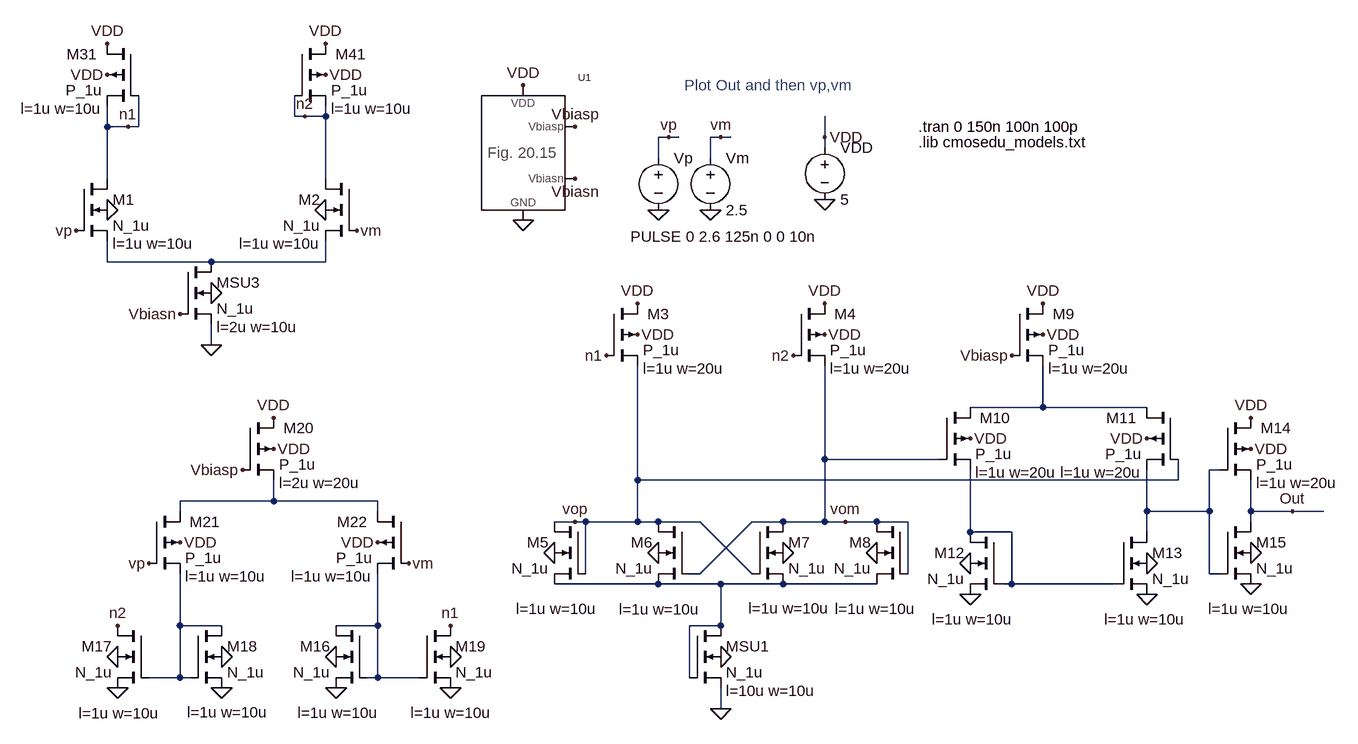
[diagram p0: schematic Fig27_13.asc]
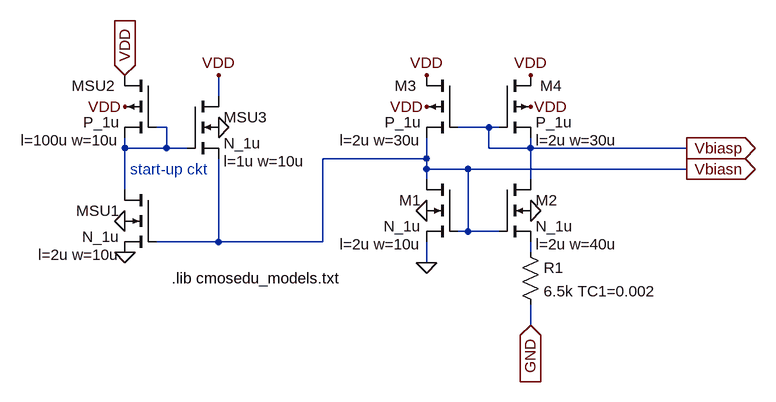
[diagram p1: sub-circuit fig_20_15.asc]
Fig27_13.asc, the LTspice schematic file:
Version 4
SHEET 1 2792 680
WIRE 672 -608 672 -640
WIRE 672 -528 672 -608
WIRE 672 -400 672 -432
WIRE 704 -608 672 -608
WIRE 720 -608 704 -608
WIRE 720 -608 720 -656
WIRE 784 -16 784 -32
WIRE 784 160 784 80
WIRE 784 240 736 240
WIRE 784 240 784 160
WIRE 800 240 784 240
WIRE 832 -400 672 -400
WIRE 832 -272 832 -304
WIRE 848 160 784 160
WIRE 928 -32 784 -32
WIRE 928 -32 928 -64
WIRE 960 -624 960 -656
WIRE 976 -624 960 -624
WIRE 1008 -624 976 -624
WIRE 1008 -624 1008 -640
WIRE 1008 -528 1008 -624
WIRE 1008 -400 832 -400
WIRE 1008 -400 1008 -432
WIRE 1088 -32 928 -32
WIRE 1088 -16 1088 -32
WIRE 1088 160 1024 160
WIRE 1088 160 1088 80
WIRE 1088 240 1072 240
WIRE 1088 240 1088 160
WIRE 1152 240 1088 240
WIRE 1392 0 1360 0
WIRE 1408 0 1392 0
WIRE 1408 80 1408 0
WIRE 1488 -64 1488 -240
WIRE 1488 0 1408 0
WIRE 1488 0 1488 -64
WIRE 1520 -560 1520 -592
WIRE 1520 0 1488 0
WIRE 1520 96 1360 96
WIRE 1536 -592 1520 -592
WIRE 1552 -592 1536 -592
WIRE 1568 240 1568 160
WIRE 1584 0 1520 0
WIRE 1584 80 1568 80
WIRE 1600 -560 1600 -592
WIRE 1616 -592 1600 -592
WIRE 1616 96 1520 96
WIRE 1616 160 1568 160
WIRE 1616 160 1616 96
WIRE 1616 288 1616 256
WIRE 1632 -592 1616 -592
WIRE 1664 0 1584 80
WIRE 1664 80 1584 0
WIRE 1712 0 1664 0
WIRE 1712 96 1616 96
WIRE 1776 -592 1776 -624
WIRE 1776 -576 1776 -592
WIRE 1776 -96 1776 -240
WIRE 1776 0 1712 0
WIRE 1776 0 1776 -96
WIRE 1808 0 1776 0
WIRE 1856 0 1808 0
WIRE 1856 96 1712 96
WIRE 1904 0 1856 0
WIRE 1904 80 1904 0
WIRE 1952 -96 1776 -96
WIRE 2000 16 2000 -80
WIRE 2064 16 2000 16
WIRE 2064 96 2048 96
WIRE 2064 96 2064 16
WIRE 2112 -176 2000 -176
WIRE 2112 -176 2112 -240
WIRE 2224 96 2064 96
WIRE 2272 -176 2112 -176
WIRE 2272 -16 2272 -80
WIRE 2272 16 2272 -16
WIRE 2320 -64 1488 -64
WIRE 2320 -64 2320 -96
WIRE 2368 -16 2272 -16
WIRE 2368 -16 2368 -80
WIRE 2368 80 2368 -16
WIRE 2384 -80 2368 -80
WIRE 2384 80 2368 80
WIRE 2432 -16 2432 -64
WIRE 2432 0 2432 -16
WIRE 2496 -16 2432 -16
WIRE 2544 -16 2496 -16
FLAG 1776 -496 0
FLAG 1776 -592 VDD
FLAG 832 -352 0
FLAG 672 -688 VDD
FLAG 1008 -688 VDD
FLAG 1312 -672 VDD
FLAG 1312 -464 0
FLAG 1392 -608 Vbiasp
FLAG 1392 -528 Vbiasn
FLAG 832 -272 0
FLAG 784 -320 Vbiasn
FLAG 672 -736 VDD
FLAG 1008 -736 VDD
FLAG 672 -480 0
FLAG 1008 -480 0
FLAG 624 -448 vp
FLAG 1056 -448 vm
FLAG 1520 -480 0
FLAG 1536 -592 vp
FLAG 1600 -480 0
FLAG 1616 -592 vm
FLAG 1488 -288 VDD
FLAG 1488 -336 VDD
FLAG 1776 -288 VDD
FLAG 1776 -336 VDD
FLAG 1360 48 0
FLAG 1520 48 0
FLAG 1712 48 0
FLAG 1856 48 0
FLAG 1392 0 vop
FLAG 1808 0 vom
FLAG 1728 -256 n2
FLAG 1440 -256 n1
FLAG 1616 208 0
FLAG 1616 288 0
FLAG 2112 -288 VDD
FLAG 2112 -336 VDD
FLAG 2064 -256 Vbiasp
FLAG 2000 -128 VDD
FLAG 2272 -128 VDD
FLAG 2000 64 0
FLAG 2000 112 0
FLAG 2272 64 0
FLAG 2272 112 0
FLAG 2432 -112 VDD
FLAG 2432 -160 VDD
FLAG 2432 48 0
FLAG 2432 96 0
FLAG 2496 -16 Out
FLAG 704 -608 n1
FLAG 976 -624 n2
FLAG 1024 208 0
FLAG 688 208 0
FLAG 848 208 0
FLAG 1200 208 0
FLAG 1200 256 0
FLAG 1024 256 0
FLAG 848 256 0
FLAG 688 256 0
FLAG 1200 160 n1
FLAG 688 160 n2
FLAG 928 -112 VDD
FLAG 928 -160 VDD
FLAG 784 32 VDD
FLAG 1088 32 VDD
FLAG 880 -80 Vbiasp
FLAG 1136 64 vm
FLAG 736 64 vp
SYMBOL voltage 1776 -592 R0
SYMATTR InstName VDD
SYMATTR Value 5
SYMBOL nmos4 784 -400 R0
WINDOW 123 56 100 Left 0
SYMATTR Value2 l=2u w=10u
SYMATTR InstName MSU3
SYMATTR Value N_1u
SYMBOL pmos4 720 -736 M0
WINDOW 0 63 16 Left 0
WINDOW 123 56 100 Left 0
SYMATTR InstName M31
SYMATTR Value2 l=1u w=10u
SYMATTR Value P_1u
SYMBOL pmos4 960 -736 R0
WINDOW 0 63 16 Left 0
WINDOW 123 56 100 Left 0
SYMATTR InstName M41
SYMATTR Value2 l=1u w=10u
SYMATTR Value P_1u
SYMBOL nmos4 1056 -528 M0
WINDOW 123 56 100 Left 0
SYMATTR Value2 l=1u w=10u
SYMATTR InstName M2
SYMATTR Value N_1u
SYMBOL nmos4 624 -528 R0
WINDOW 123 56 100 Left 0
SYMATTR Value2 l=1u w=10u
SYMATTR InstName M1
SYMATTR Value N_1u
SYMBOL Fig_20_15 1248 -560 R0
SYMATTR InstName U1
SYMBOL voltage 1520 -576 R0
WINDOW 3 -43 137 Left 0
WINDOW 123 0 0 Left 0
WINDOW 39 0 0 Left 0
SYMATTR Value PULSE 0 2.6 125n 0 0 10n
SYMATTR InstName Vp
SYMBOL voltage 1600 -576 R0
SYMATTR InstName Vm
SYMATTR Value 2.5
SYMBOL pmos4 1440 -336 R0
WINDOW 0 63 16 Left 0
WINDOW 123 56 100 Left 0
SYMATTR InstName M3
SYMATTR Value2 l=1u w=20u
SYMATTR Value P_1u
SYMBOL pmos4 1728 -336 R0
WINDOW 0 63 16 Left 0
WINDOW 123 56 100 Left 0
SYMATTR InstName M4
SYMATTR Value2 l=1u w=20u
SYMATTR Value P_1u
SYMBOL nmos4 1408 0 M0
WINDOW 123 -18 134 Left 0
SYMATTR Value2 l=1u w=10u
SYMATTR InstName M5
SYMATTR Value N_1u
SYMBOL nmos4 1568 0 M0
WINDOW 123 -17 135 Left 0
SYMATTR Value2 l=1u w=10u
SYMATTR InstName M6
SYMATTR Value N_1u
SYMBOL nmos4 1664 0 R0
WINDOW 123 -5 133 Left 0
SYMATTR Value2 l=1u w=10u
SYMATTR InstName M7
SYMATTR Value N_1u
SYMBOL nmos4 1904 0 M0
WINDOW 123 -13 134 Left 0
SYMATTR Value2 l=1u w=10u
SYMATTR InstName M8
SYMATTR Value N_1u
SYMBOL nmos4 1568 160 R0
WINDOW 123 56 100 Left 0
SYMATTR Value2 l=10u w=10u
SYMATTR InstName MSU1
SYMATTR Value N_1u
SYMBOL pmos4 2064 -336 R0
WINDOW 0 63 16 Left 0
WINDOW 123 56 100 Left 0
SYMATTR InstName M9
SYMATTR Value2 l=1u w=20u
SYMATTR Value P_1u
SYMBOL pmos4 1952 -176 R0
WINDOW 0 63 16 Left 0
WINDOW 123 56 100 Left 0
SYMATTR InstName M10
SYMATTR Value2 l=1u w=20u
SYMATTR Value P_1u
SYMBOL pmos4 2320 -176 M0
WINDOW 0 63 16 Left 0
WINDOW 123 56 100 Left 0
SYMATTR InstName M11
SYMATTR Value2 l=1u w=20u
SYMATTR Value P_1u
SYMBOL nmos4 2048 16 M0
WINDOW 123 -18 134 Left 0
SYMATTR Value2 l=1u w=10u
SYMATTR InstName M12
SYMATTR Value N_1u
SYMBOL nmos4 2224 16 R0
WINDOW 123 -18 134 Left 0
SYMATTR Value2 l=1u w=10u
SYMATTR InstName M13
SYMATTR Value N_1u
SYMBOL pmos4 2384 -160 R0
WINDOW 0 63 16 Left 0
WINDOW 123 56 100 Left 0
SYMATTR InstName M14
SYMATTR Value2 l=1u w=20u
SYMATTR Value P_1u
SYMBOL nmos4 2384 0 R0
WINDOW 123 -18 134 Left 0
SYMATTR Value2 l=1u w=10u
SYMATTR InstName M15
SYMATTR Value N_1u
SYMBOL nmos4 1072 160 M0
WINDOW 123 -18 134 Left 0
SYMATTR Value2 l=1u w=10u
SYMATTR InstName M16
SYMATTR Value N_1u
SYMBOL nmos4 736 160 M0
WINDOW 123 -17 135 Left 0
SYMATTR Value2 l=1u w=10u
SYMATTR InstName M17
SYMATTR Value N_1u
SYMBOL nmos4 800 160 R0
WINDOW 123 -5 133 Left 0
SYMATTR Value2 l=1u w=10u
SYMATTR InstName M18
SYMATTR Value N_1u
SYMBOL nmos4 1152 160 R0
WINDOW 123 -13 134 Left 0
SYMATTR Value2 l=1u w=10u
SYMATTR InstName M19
SYMATTR Value N_1u
SYMBOL pmos4 880 -160 R0
WINDOW 0 63 16 Left 0
WINDOW 123 56 100 Left 0
SYMATTR InstName M20
SYMATTR Value2 l=2u w=20u
SYMATTR Value P_1u
SYMBOL pmos4 736 -16 R0
WINDOW 0 63 16 Left 0
WINDOW 123 56 100 Left 0
SYMATTR InstName M21
SYMATTR Value2 l=1u w=10u
SYMATTR Value P_1u
SYMBOL pmos4 1136 -16 M0
WINDOW 0 63 16 Left 0
WINDOW 123 56 100 Left 0
SYMATTR InstName M22
SYMATTR Value2 l=1u w=10u
SYMATTR Value P_1u
TEXT 1920 -584 Left 0 !.lib cmosedu_models.txt
TEXT 1560 -672 Left 0 ;Plot Out and then vp,vm
TEXT 1920 -608 Left 0 !.tran 0 150n 100n 100p

fig_20_15.asc, the sub-circuit schematic file:
Version 4
SHEET 1 1548 680
WIRE 544 16 544 0
WIRE 544 80 544 16
WIRE 544 176 544 160
WIRE 608 -16 592 -16
WIRE 608 16 544 16
WIRE 608 16 608 -16
WIRE 640 16 608 16
WIRE 688 -64 688 -96
WIRE 688 160 592 160
WIRE 688 160 688 32
WIRE 848 160 688 160
WIRE 848 160 848 32
WIRE 1008 32 848 32
WIRE 1008 32 1008 0
WIRE 1008 48 1008 32
WIRE 1008 64 1008 48
WIRE 1008 192 1008 160
WIRE 1072 48 1008 48
WIRE 1072 144 1056 144
WIRE 1072 144 1072 48
WIRE 1104 -16 1056 -16
WIRE 1104 16 1104 -16
WIRE 1120 -16 1104 -16
WIRE 1120 144 1072 144
WIRE 1168 16 1104 16
WIRE 1168 16 1168 0
WIRE 1168 64 1168 16
WIRE 1168 176 1168 160
WIRE 1168 288 1168 256
WIRE 1408 16 1168 16
WIRE 1408 48 1072 48
FLAG 544 -48 VDD
FLAG 544 128 0
FLAG 688 -16 0
FLAG 688 -96 VDD
FLAG 1008 -48 VDD
FLAG 1008 -96 VDD
FLAG 1168 -48 VDD
FLAG 1168 -96 VDD
FLAG 1008 192 0
FLAG 1008 112 0
FLAG 1168 112 0
FLAG 544 -96 VDD
IOPIN 544 -96 In
FLAG 544 176 0
FLAG 1408 16 Vbiasp
IOPIN 1408 16 Out
FLAG 1408 48 Vbiasn
IOPIN 1408 48 Out
FLAG 1168 288 GND
IOPIN 1168 288 In
SYMBOL pmos4 592 -96 M0
WINDOW 0 63 16 Left 0
WINDOW 123 56 100 Left 0
SYMATTR InstName MSU2
SYMATTR Value2 l=100u w=10u
SYMATTR Value P_1u
SYMBOL nmos4 592 80 M0
WINDOW 123 56 100 Left 0
SYMATTR Value2 l=2u w=10u
SYMATTR InstName MSU1
SYMATTR Value N_1u
SYMBOL nmos4 640 -64 R0
WINDOW 123 56 100 Left 0
SYMATTR Value2 l=1u w=10u
SYMATTR InstName MSU3
SYMATTR Value N_1u
SYMBOL pmos4 1056 -96 M0
WINDOW 0 63 16 Left 0
WINDOW 123 56 100 Left 0
SYMATTR InstName M3
SYMATTR Value2 l=2u w=30u
SYMATTR Value P_1u
SYMBOL pmos4 1120 -96 R0
WINDOW 0 63 16 Left 0
WINDOW 123 56 100 Left 0
SYMATTR InstName M4
SYMATTR Value2 l=2u w=30u
SYMATTR Value P_1u
SYMBOL nmos4 1056 64 M0
WINDOW 123 56 100 Left 0
SYMATTR Value2 l=2u w=10u
SYMATTR InstName M1
SYMATTR Value N_1u
SYMBOL nmos4 1120 64 R0
WINDOW 123 56 100 Left 0
SYMATTR Value2 l=2u w=40u
SYMATTR InstName M2
SYMATTR Value N_1u
SYMBOL res 1152 160 R0
SYMATTR InstName R1
SYMATTR Value 6.5k TC1=0.002
TEXT 552 48 Left 0 ;start-up ckt
TEXT 616 216 Left 0 !.lib cmosedu_models.txt

The netlist it stands for:
* Fig27_13.asc
VDD VDD 0 5
MSU3 N001 Vbiasn 0 0 N_1u l=2u w=10u
M31 VDD n1 n1 VDD P_1u l=1u w=10u
M41 VDD n2 n2 VDD P_1u l=1u w=10u
M2 n2 vm N001 0 N_1u l=1u w=10u
M1 n1 vp N001 0 N_1u l=1u w=10u
XU1 Vbiasn Vbiasp VDD 0 fig_20_15
Vp vp 0 PULSE 0 2.6 125n 0 0 10n
Vm vm 0 2.5
M3 VDD n1 vop VDD P_1u l=1u w=20u
M4 VDD n2 vom VDD P_1u l=1u w=20u
M5 vop vop N005 0 N_1u l=1u w=10u
M6 vop vom N005 0 N_1u l=1u w=10u
M7 vom vop N005 0 N_1u l=1u w=10u
M8 vom vom N005 0 N_1u l=1u w=10u
MSU1 N005 N005 0 0 N_1u l=10u w=10u
M9 VDD Vbiasp N007 VDD P_1u l=1u w=20u
M10 N007 vom N006 VDD P_1u l=1u w=20u
M11 N007 vop N008 VDD P_1u l=1u w=20u
M12 N006 N006 0 0 N_1u l=1u w=10u
M13 N008 N006 0 0 N_1u l=1u w=10u
M14 VDD N008 Out VDD P_1u l=1u w=20u
M15 Out N008 0 0 N_1u l=1u w=10u
M16 N004 N004 0 0 N_1u l=1u w=10u
M17 n2 N003 0 0 N_1u l=1u w=10u
M18 N003 N003 0 0 N_1u l=1u w=10u
M19 n1 N004 0 0 N_1u l=1u w=10u
M20 VDD Vbiasp N002 VDD P_1u l=2u w=20u
M21 N002 vp N003 VDD P_1u l=1u w=10u
M22 N002 vm N004 VDD P_1u l=1u w=10u

* block symbol definitions
.subckt fig_20_15 Vbiasn Vbiasp VDD GND
MSU2 VDD N001 N001 VDD P_1u l=100u w=10u
MSU1 N001 Vbiasn 0 0 N_1u l=2u w=10u
MSU3 VDD N001 Vbiasn 0 N_1u l=1u w=10u
M3 VDD Vbiasp Vbiasn VDD P_1u l=2u w=30u
M4 VDD Vbiasp Vbiasp VDD P_1u l=2u w=30u
M1 Vbiasn Vbiasn 0 0 N_1u l=2u w=10u
M2 Vbiasp Vbiasn N002 0 N_1u l=2u w=40u
R1 N002 GND 6.5k TC1=0.002
* start-up ckt
.lib cmosedu_models.txt
.ends fig_20_15

.model NMOS NMOS
.model PMOS PMOS
.lib standard.mos
.lib cmosedu_models.txt
* Plot Out and then vp,vm
.tran 0 150n 100n 100p
.backanno
.end